# EAGLE design power (EAGLE 9.3.0)
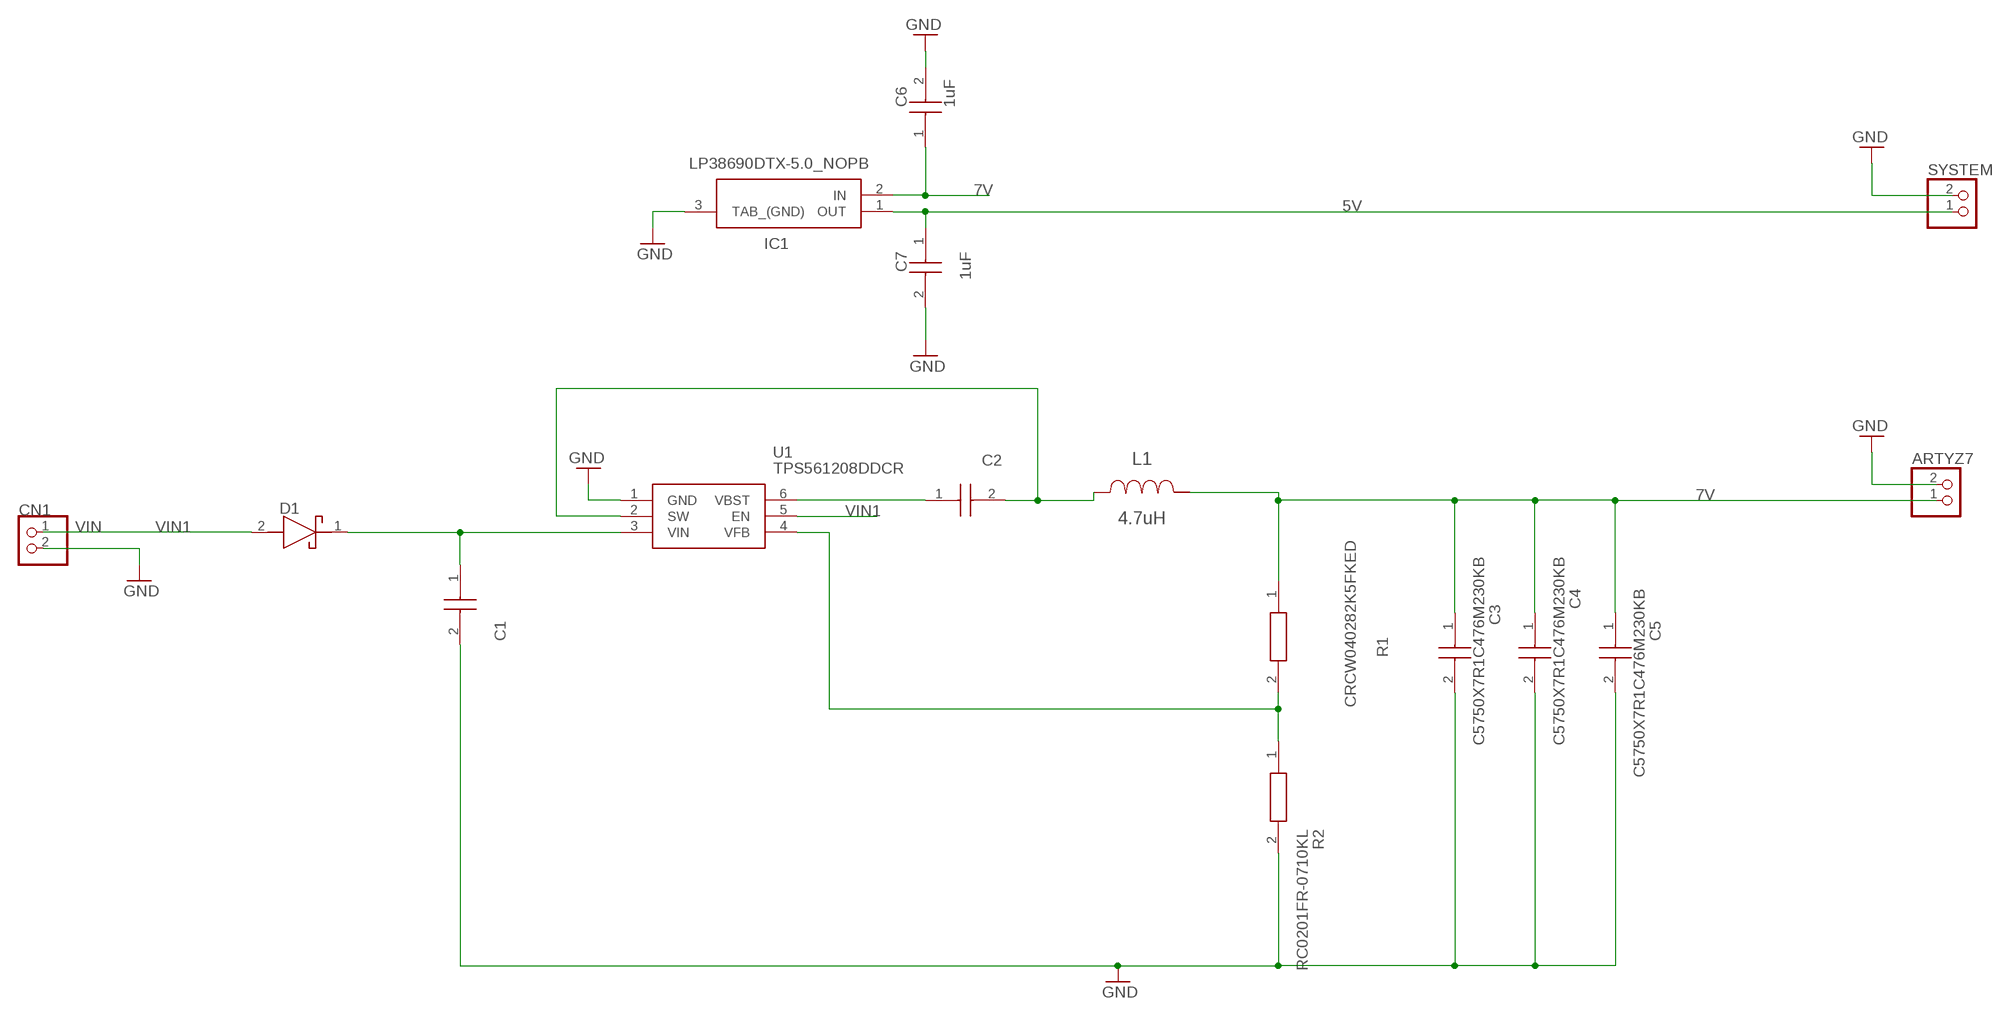
[diagram p0: schematic, sheet 1]

## Parts
ARTYZ7  JST_2PIN-SMT-RA  [JST-PH-2-SMT-RA]
C1  593D226X9025D2TE3  [CAPPM7343X310N]
C2  C0603C104Z3VACTU  [CAPC1608X90N]
C3  C5750X7R1C476M230KB  [CAPC5750X250N]
C4  C5750X7R1C476M230KB  [CAPC5750X250N]
C5  C5750X7R1C476M230KB  [CAPC5750X250N]
C6  1uF  C1608X5R1A106M080AC  [CAPC1608X80N]
C7  1uF  C1608X5R1A106M080AC  [CAPC1608X80N]
CN1  JST_2PIN-SMT-RA  [JST-PH-2-SMT-RA]
D1  NRVB120VLSFT1G  [SODFL3616X98N]
IC1  LP38690DTX-5.0_NOPB  [LM78M05CDT]
L1  4.7uH  SLF7045T-4R7M2R0-PFSLF7045T-4R7M2R0-PF  [SLF7045]
R1  CRCW040282K5FKED  [RESC1005X40N]
R2  RC0201FR-0710KL  [RESC0603X26N]
SYSTEM  JST_2PIN-SMT-RA  [JST-PH-2-SMT-RA]
U1  TPS561208DDCR  [SOT95P280X110-6N]

## Nets
5V: C7.1 IC1.1(OUT) SYSTEM.1
7V: ARTYZ7.1 C3.1 C4.1 C5.1 C6.1 IC1.2(IN) L1.2 R1.1
GND: ARTYZ7.2 C1.2(-) C3.2 C4.2 C5.2 C6.2 C7.2 CN1.2 IC1.3(TAB_(GND)) R2.2 SYSTEM.2 U1.1(GND)
N$2: C2.1 U1.6(VBST)
N$3: C2.2 L1.1 U1.2(SW)
N$5: R1.2 R2.1 U1.4(VFB)
VIN: CN1.1 D1.2(A)
VIN1: C1.1(+) D1.1(K) U1.3(VIN) U1.5(EN)

## Library data of the parts
ARTYZ7 CN1 SYSTEM = adafruit:JST_2PIN: JST 2-Pin Connectors of various flavors SMT-RA (S2B-PH-SM4) 4UConnector #17311 SMT (B2B-PH-SM4) THM-RA (S2B-PH) THM (B2B-PH)
C1 = SamacSys_Parts:593D226X9025D2TE3: Vishay 22uF 25V dc Tantalum Capacitor MnO2 Solid +/-10% Tolerance 593D Series Source: Datasheet <https://componentsearchengine.com/Datasheets/1/593D226X9025D2TE3.pdf>; DESCRIPTION: Vishay 22uF 25V dc Tantalum Capacitor MnO2 Solid +/-10% Tolerance 593D Series; HEIGHT: 3.1mm; MANUFACTURER_NAME: Vishay; MANUFACTURER_PART_NUMBER: 593D226X9025D2TE3; MOUSER_PART_NUMBER: 74-593D226X9025D2TE3; MOUSER_PRICE-STOCK: https://www.mouser.com/Search/Refine.aspx?Keyword=74-593D226X9025D2TE3
C2 = SamacSys_Parts:C0603C104Z3VACTU: KEMET 100nF Multilayer Ceramic Capacitor MLCC 25V dc -20 +80% Y5V Dielectric 0603 (1608M), Max. Temp. +85C Source: Datasheet <http://www.mouser.com/datasheet/2/212/KEM_C1005_Y5V_SMD-1101305.pdf>; DESCRIPTION: KEMET 100nF Multilayer Ceramic Capacitor MLCC 25V dc -20 +80% Y5V Dielectric 0603 (1608M), Max. Temp. +85C; HEIGHT: 0.9mm; MANUFACTURER_NAME: Kemet; MANUFACTURER_PART_NUMBER: C0603C104Z3VACTU; MOUSER_PART_NUMBER: 80-C0603C104Z3V; MOUSER_PRICE-STOCK: https://www.mouser.com/Search/Refine.aspx?Keyword=80-C0603C104Z3V
C3-C5 = SamacSys_Parts:C5750X7R1C476M230KB: TDK - C5750X7R1C476M230KB - CAP, MLCC, X7R, 47UF, 16V, 2220 Source: Datasheet <https://componentsearchengine.com/Datasheets/1/C5750X7R1C476M230KB.pdf>; DESCRIPTION: TDK - C5750X7R1C476M230KB - CAP, MLCC, X7R, 47UF, 16V, 2220; HEIGHT: 2.5mm; MANUFACTURER_NAME: TDK; MANUFACTURER_PART_NUMBER: C5750X7R1C476M230KB; MOUSER_PART_NUMBER: 810-C5750X7R1C476M; MOUSER_PRICE-STOCK: https://www.mouser.com/Search/Refine.aspx?Keyword=810-C5750X7R1C476M
C6 C7 = SamacSys_Parts:C1608X5R1A106M080AC: TDK - C1608X5R1A106M080AC - CAP, MLCC, X5R, 10UF, 10V, 0603 Source: Datasheet <https://componentsearchengine.com/Datasheets/1/C1608X5R1A106M080AC.pdf>; DESCRIPTION: TDK - C1608X5R1A106M080AC - CAP, MLCC, X5R, 10UF, 10V, 0603; HEIGHT: 0.8mm; MANUFACTURER_NAME: TDK; MANUFACTURER_PART_NUMBER: C1608X5R1A106M080AC; MOUSER_PART_NUMBER: 810-C1608X5R1A106M; MOUSER_PRICE-STOCK: https://www.mouser.com/Search/Refine.aspx?Keyword=810-C1608X5R1A106M
D1 = SamacSys_Parts:NRVB120VLSFT1G: ON SEMICONDUCTOR - NRVB120VLSFT1G - SCHOTTKY RECT, AEC-Q101, 20V,SOD-123FL Source: Datasheet <https://componentsearchengine.com/Datasheets/1/NRVB120VLSFT1G.pdf>; DESCRIPTION: ON SEMICONDUCTOR - NRVB120VLSFT1G - SCHOTTKY RECT, AEC-Q101, 20V,SOD-123FL; HEIGHT: 0.98mm; MANUFACTURER_NAME: ON Semiconductor; MANUFACTURER_PART_NUMBER: NRVB120VLSFT1G; MOUSER_PART_NUMBER: 863-NRVB120VLSFT1G; MOUSER_PRICE-STOCK: https://www.mouser.com/Search/Refine.aspx?Keyword=863-NRVB120VLSFT1G
IC1 = SamacSys_Parts:LP38690DTX-5.0_NOPB: 1A Low Dropout CMOS Linear Regulators Stable with Ceramic Output Capacitors Source: Datasheet <http://www.ti.com/lit/ds/symlink/lp38690.pdf>; DESCRIPTION: 1A Low Dropout CMOS Linear Regulators Stable with Ceramic Output Capacitors; HEIGHT: mm; MANUFACTURER_NAME: Texas Instruments; MANUFACTURER_PART_NUMBER: LP38690DTX-5.0/NOPB; MOUSER_PART_NUMBER: 926-LP38690DTX50NOPB; MOUSER_PRICE-STOCK: https://www.mouser.com/Search/Refine.aspx?Keyword=926-LP38690DTX50NOPB
L1 = AcceleratedDesigns_Lib:SLF7045T-4R7M2R0-PF; DATASHEET_URL: http://www.tdk.co.jp/tjfx01/j531%5Fslf.pdf; DCR: 0.036; IDC: 2.0; L: 4.7E-6; MANUFACTURER_NAME: TDK; MANUFACTURER_PART_NUMBER: SLF7045T-4R7M2R0-PF; VENDOR: TDK
R1 = SamacSys_Parts:CRCW040282K5FKED: Vishay CRCW Series Thick Film Surface Mount Resistor 0402 Case 82.5k +/-1% 0.063W +/-100ppm/C Source: Datasheet <https://componentsearchengine.com/Datasheets/1/CRCW040282K5FKED.pdf>; DESCRIPTION: Vishay CRCW Series Thick Film Surface Mount Resistor 0402 Case 82.5k +/-1% 0.063W +/-100ppm/C; HEIGHT: 0.4mm; MANUFACTURER_NAME: Vishay; MANUFACTURER_PART_NUMBER: CRCW040282K5FKED; MOUSER_PART_NUMBER: 71-CRCW0402-82.5K-E3; MOUSER_PRICE-STOCK: https://www.mouser.com/Search/Refine.aspx?Keyword=71-CRCW0402-82.5K-E3
R2 = SamacSys_Parts:RC0201FR-0710KL: Thick Film Resistors - SMD 10K OHM 1% Source: Datasheet <http://www.mouser.com/datasheet/2/447/PYu-RC_Group_51_RoHS_L_10-1527934.pdf>; DESCRIPTION: Thick Film Resistors - SMD 10K OHM 1%; HEIGHT: 0.26mm; MANUFACTURER_NAME: YAGEO (PHYCOMP); MANUFACTURER_PART_NUMBER: RC0201FR-0710KL; MOUSER_PART_NUMBER: 603-RC0201FR-0710KL; MOUSER_PRICE-STOCK: https://www.mouser.com/Search/Refine.aspx?Keyword=603-RC0201FR-0710KL
U1 = SamacSys_Parts:TPS561208DDCR: 4.5V to 17V Input, 2A Output, Synchronous SWIFT Step-Down Converter Source: Datasheet <http://www.ti.com/lit/gpn/tps561208>; DESCRIPTION: 4.5V to 17V Input, 2A Output, Synchronous SWIFT Step-Down Converter; HEIGHT: 1.1mm; MANUFACTURER_NAME: Texas Instruments; MANUFACTURER_PART_NUMBER: TPS561208DDCR; MOUSER_PART_NUMBER: 595-TPS561208DDCR

## Board
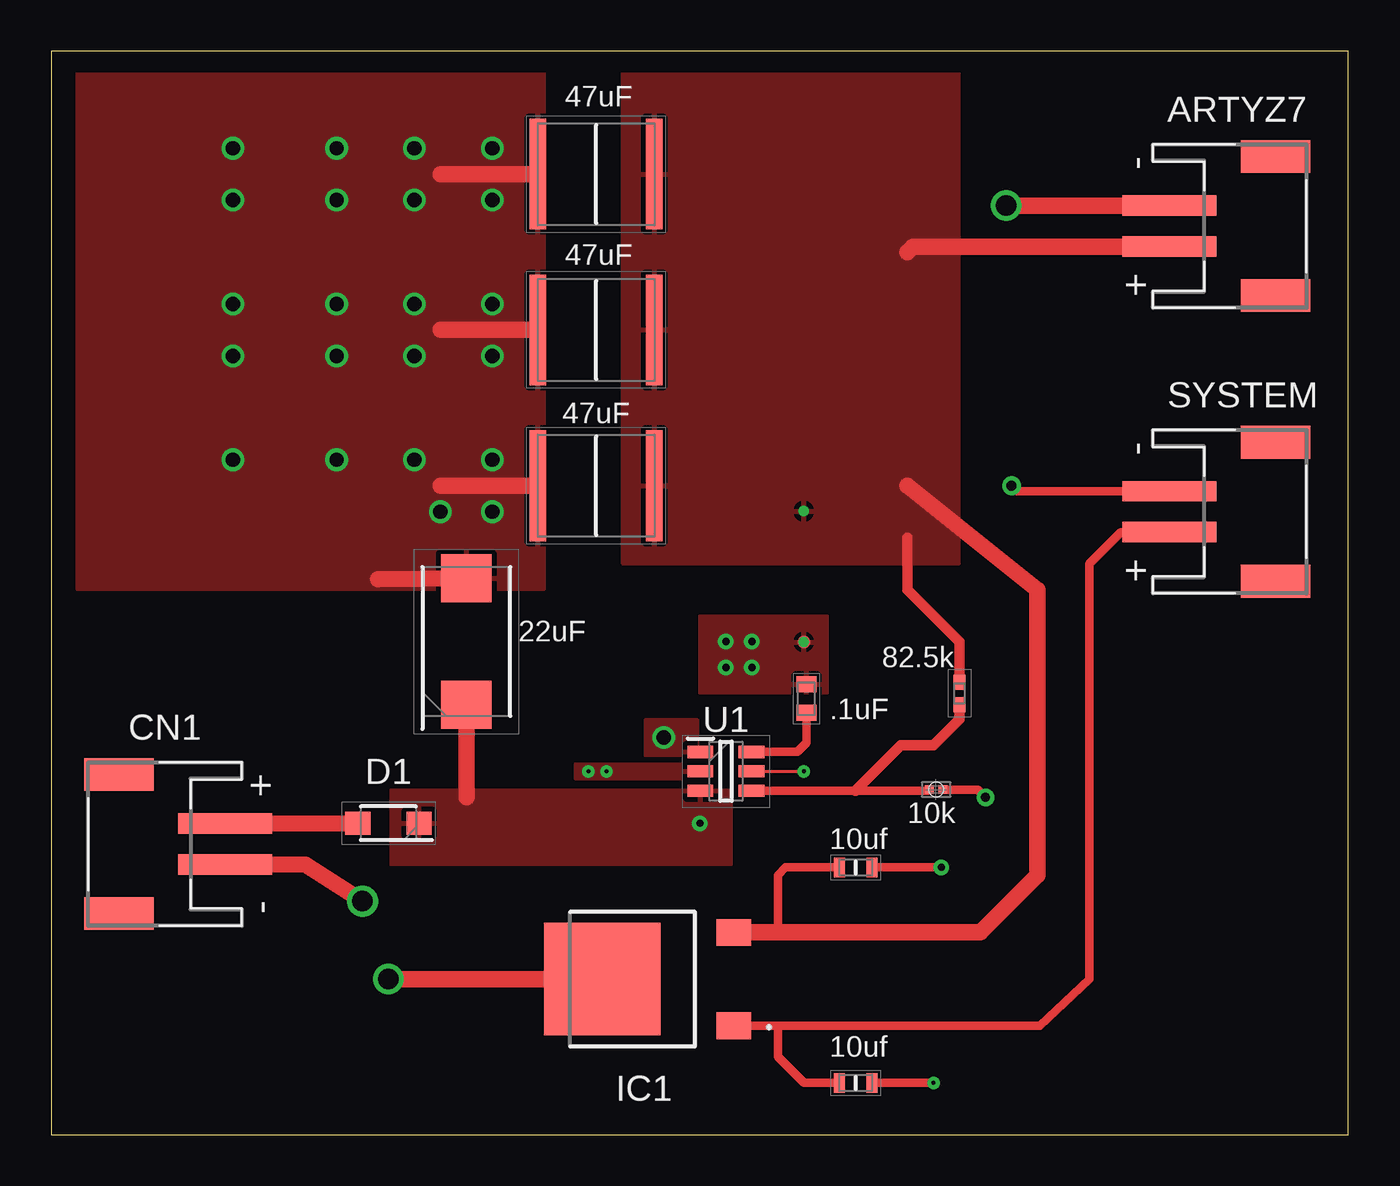
[diagram p1: board, top side]
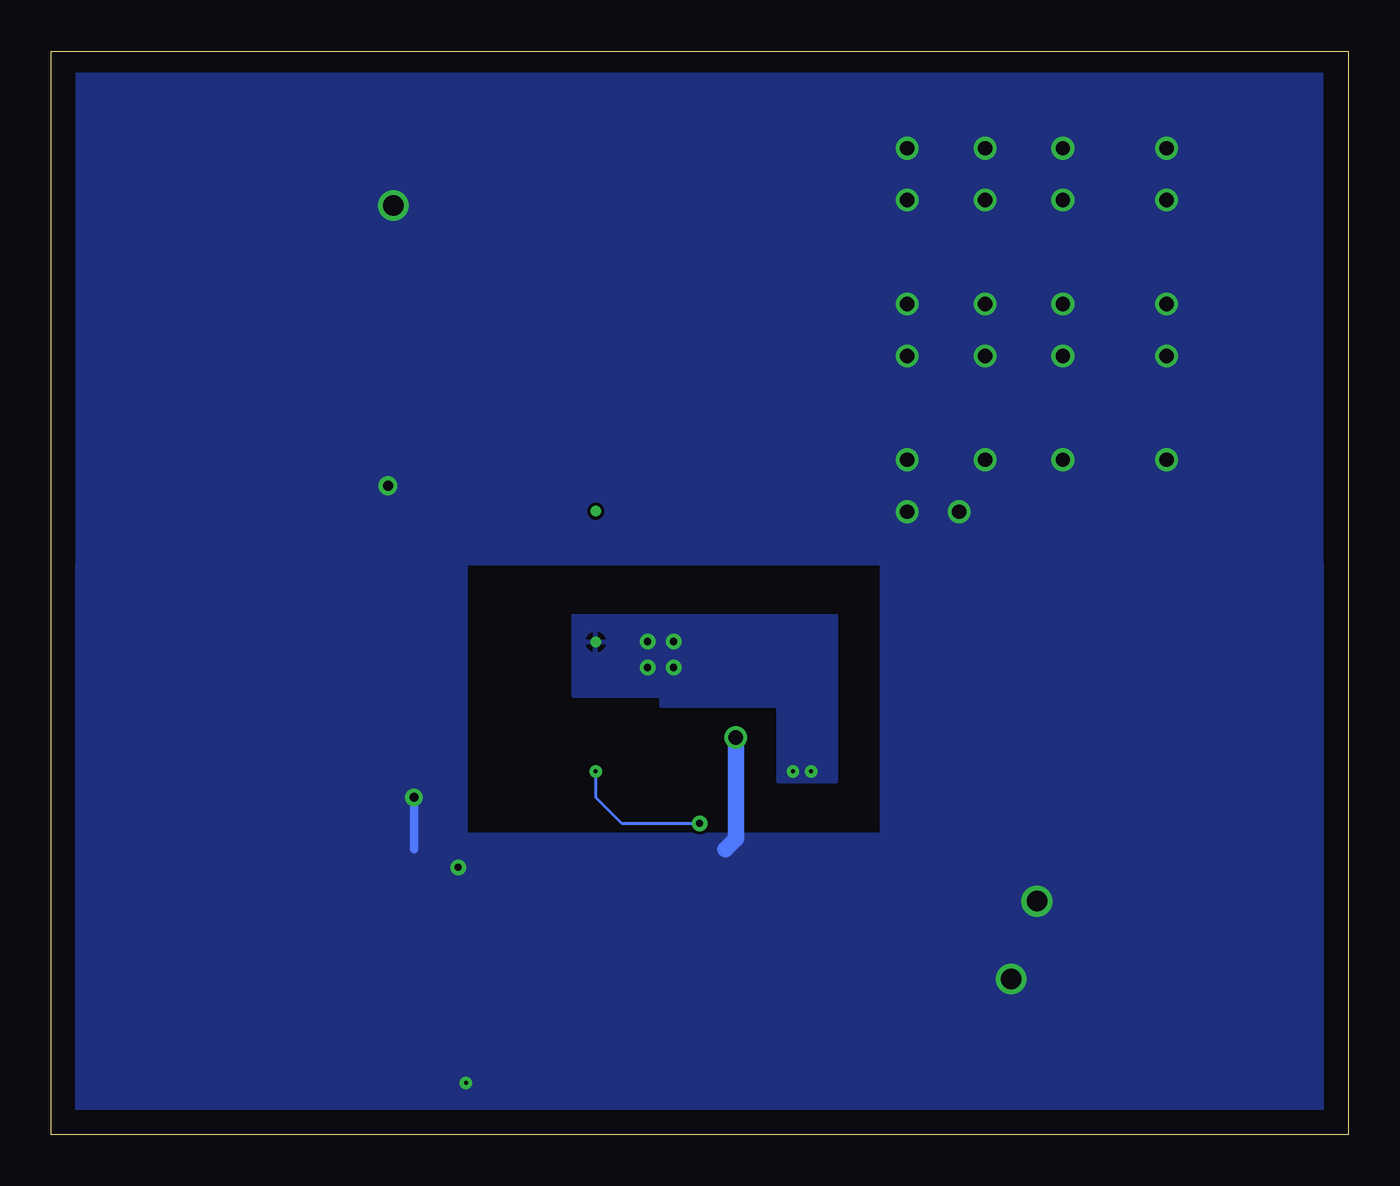
[diagram p2: board, bottom side, seen from below]

Size 63.48 x 53.01 mm. Coordinates in mm from the lower left corner, seen from the top.
Outline: 0,0 63.48,0 63.48,53.01 0,53.01 0,0
Copper layers (1*16): Top 0.035mm / dielectric 1.5mm / Bottom 0.035mm
Design rules "default": minimum track width 6mil, minimum drill 0.35mm, track to track 6mil, track to pad 6mil, pad to pad 6mil, via to via 6mil, smd to smd 6mil, copper to edge 40mil, drill to drill 6mil, minimum pad ring 10mil, minimum via ring 8mil, stop-mask expansion 4mil, vias tented up to drill 0mil, thermal gap 10mil

### Footprints (pad centres in the part's own frame; a part is rotated, then mirrored left to right if it is on the bottom)
JST-PH-2-SMT-RA = smd 1 x 4.6: 1 1,-3.7; 2 -1,-3.7 | smd 1.6 x 3.4: NC1 -3.4,1.5; NC2 3.4,1.5
CAPPM7343X310N = smd 2.35 x 2.45: 1 -3.1,0; 2 3.1,0
CAPC1608X90N = smd 0.78 x 0.98: 1 -0.7,0; 2 0.7,0
CAPC5750X250N = smd 0.81 x 5.41: 1 -2.85,0; 2 2.85,0
CAPC1608X80N = smd 0.54 x 0.94: 1 -0.8,0; 2 0.8,0
SODFL3616X98N = smd 1.24 x 1.12: 1 -1.5,0; 2 1.5,0
LM78M05CDT = smd 1.3 x 1.7: 1 -2.285,-8; 2 2.285,-8 | smd 5.5 x 5.7: 3 0,-1.56
SLF7045 = drill 0: 1 -3.2,0; 2 3.2,0
RESC1005X40N = smd 0.75 x 0.6: 1 -0.55,0; 2 0.55,0
RESC0603X26N = smd 0.44 x 0.42: 1 -0.34,0; 2 0.34,0
SOT95P280X110-6N = smd 1.25 x 0.6: 1 -1.25,0.95; 2 -1.25,0; 3 -1.25,-0.95; 4 1.25,-0.95; 5 1.25,0; 6 1.25,0.95

### Placement (x,y rotation side)
ARTYZ7  58.42,44.45 270 top
C1  20.32,24.13 90 top
C2  36.96,21.34 90 top
C3  26.67,46.99 180 top
C4  26.67,31.75 180 top
C5  26.67,39.37 180 top
C6  39.37,13.08 0 top
C7  39.37,2.54 0 top
CN1  4.83,14.22 90 top
D1  16.51,15.24 180 top
IC1  25.4,7.62 90 top
L1  36.83,27.3 90 top
R1  44.45,21.59 270 top
R2  43.31,16.89 0 top
SYSTEM  58.42,30.48 270 top
U1  33.02,17.78 0 top

### Tracks (layer width: path | path; a pad name or v marks a point on that pad's centre or on a via)
5V
  Top 0.406: IC1.1 35.56,5.34 | 35.56,5.34 48.39,5.33 50.8,7.62 50.8,10.16 50.8,27.94 52.34,29.48 SYSTEM.1 | C7.1 36.83,2.54 35.56,3.81 | 35.56,3.81 | 35.56,3.81 35.56,5.34
7V
  Top 0.406: C6.1 35.94,13.08 35.56,12.7 35.56,9.91
  Top 0.508: R1.1 44.45,24.13 41.91,26.67 41.91,29.21
  Top 0.813: IC1.2 35.56,9.91 45.47,9.91 48.26,12.7 48.26,26.67 41.91,31.75 | ARTYZ7.1 42.18,43.45 41.91,43.18
  pour Top: 44.45,52.07 27.94,52.07 27.94,27.94 44.45,27.94
GND  (via drill 0.2, 0.35 pad 0.55, 0.45 pad 0.55, 0.5 pad 0.55, 0.7 pad 0.55, 1, 1 pad 0.55)
  Top 0.406: R2.2 45.34,16.89 v45.72,16.51 | C6.2 v43.56,13.08 | C7.2 v43.18,2.54 | 54.45,31.75 SYSTEM.2 47.26,31.48 v46.99,31.75
  Top 0.813: IC1.3 v16.51,7.62 | CN1.2 12.45,13.21 v15.24,11.43 | C3.2 19.05,46.99 | C5.2 19.05,39.37 | C4.2 19.05,31.75 | C1.2 16,27.18 | v46.74,45.47 46.75,45.45 ARTYZ7.2
  Bottom 0.406: v45.72,16.51 45.72,13.97
  Bottom 0.813: v29.97,19.43 29.97,14.48 30.48,13.97
  other vias: 19.05,30.48 21.59,30.48 21.59,33.02 21.59,38.1 21.59,40.64 21.59,45.72 21.59,48.26 8.89,48.26 13.97,48.26 17.78,48.26 8.89,45.72 13.97,45.72 17.78,45.72 8.89,40.64 13.97,40.64 17.78,40.64 8.89,38.1 13.97,38.1 17.78,38.1 8.89,33.02 13.97,33.02 17.78,33.02
  pour Bottom: 12.7,52.07 24.13,52.07 24.13,27.94 12.7,27.94
  pour Bottom: 1.27,27.94 1.27,1.27 62.23,1.27 62.23,14.73 22.86,14.73 22.86,27.94
  pour Top: 29.08,20.32 31.62,20.32 31.62,18.54 29.08,18.54
  pour Bottom: 1.27,52.07 62.23,52.07 62.23,27.94 1.27,27.94
  pour Bottom: 43.18,27.94 43.18,13.97 62.23,13.97 62.23,27.94
  pour Top: 1.27,52.07 24.13,52.07 24.13,26.67 1.27,26.67
N$2
  Top 0.406: U1.6 36.51,18.73 36.96,19.18 C2.1
N$3  (via drill 0.2 pad 0.55, 0.35 pad 0.55)
  Top 0.61: L1.1 36.83,24.13
  other vias: 26.29,17.78 27.18,17.78 33.02,24.13 34.29,24.13 34.29,22.86 33.02,22.86
  pour Top: 25.65,18.16 31.5,18.16 31.5,17.4 25.65,17.4
  pour Bottom: 25.02,23.49 33.66,23.49 33.66,20.95 27.94,20.95 27.94,17.27 25.02,17.27
  pour Bottom: 25.02,21.46 25.02,25.4 37.97,25.4 37.97,21.46
  pour Top: 31.75,25.4 37.97,25.4 37.97,21.59 31.75,21.59
N$5
  Top 0.406: U1.4 39.37,16.83 42.91,16.83 R2.1
  Top 0.508: 39.37,16.83 41.59,19.05 43.18,19.05 44.45,20.32 R1.2
VIN
  Top 0.813: CN1.1 D1.2
VIN1  (via drill 0.2 pad 0.55, 0.35 pad 0.55)
  Top 0.152: U1.5 v36.83,17.78
  Top 0.813: C1.1 20.32,16.51
  Bottom 0.152: v36.83,17.78 36.83,16.51 35.56,15.24 v31.75,15.24
  pour Top: 16.64,16.89 33.27,16.89 33.27,13.21 16.64,13.21

### Text on the board
tPlace: 47uF | 47uF | 47uF | 22uF | 82.5k | .1uF | 10k | 10uf | 10uf